# Altium schematic sheet LCA_GSM.SchDoc
size 420 x 297 mm; SheetNumber: 3; SheetTotal: 3
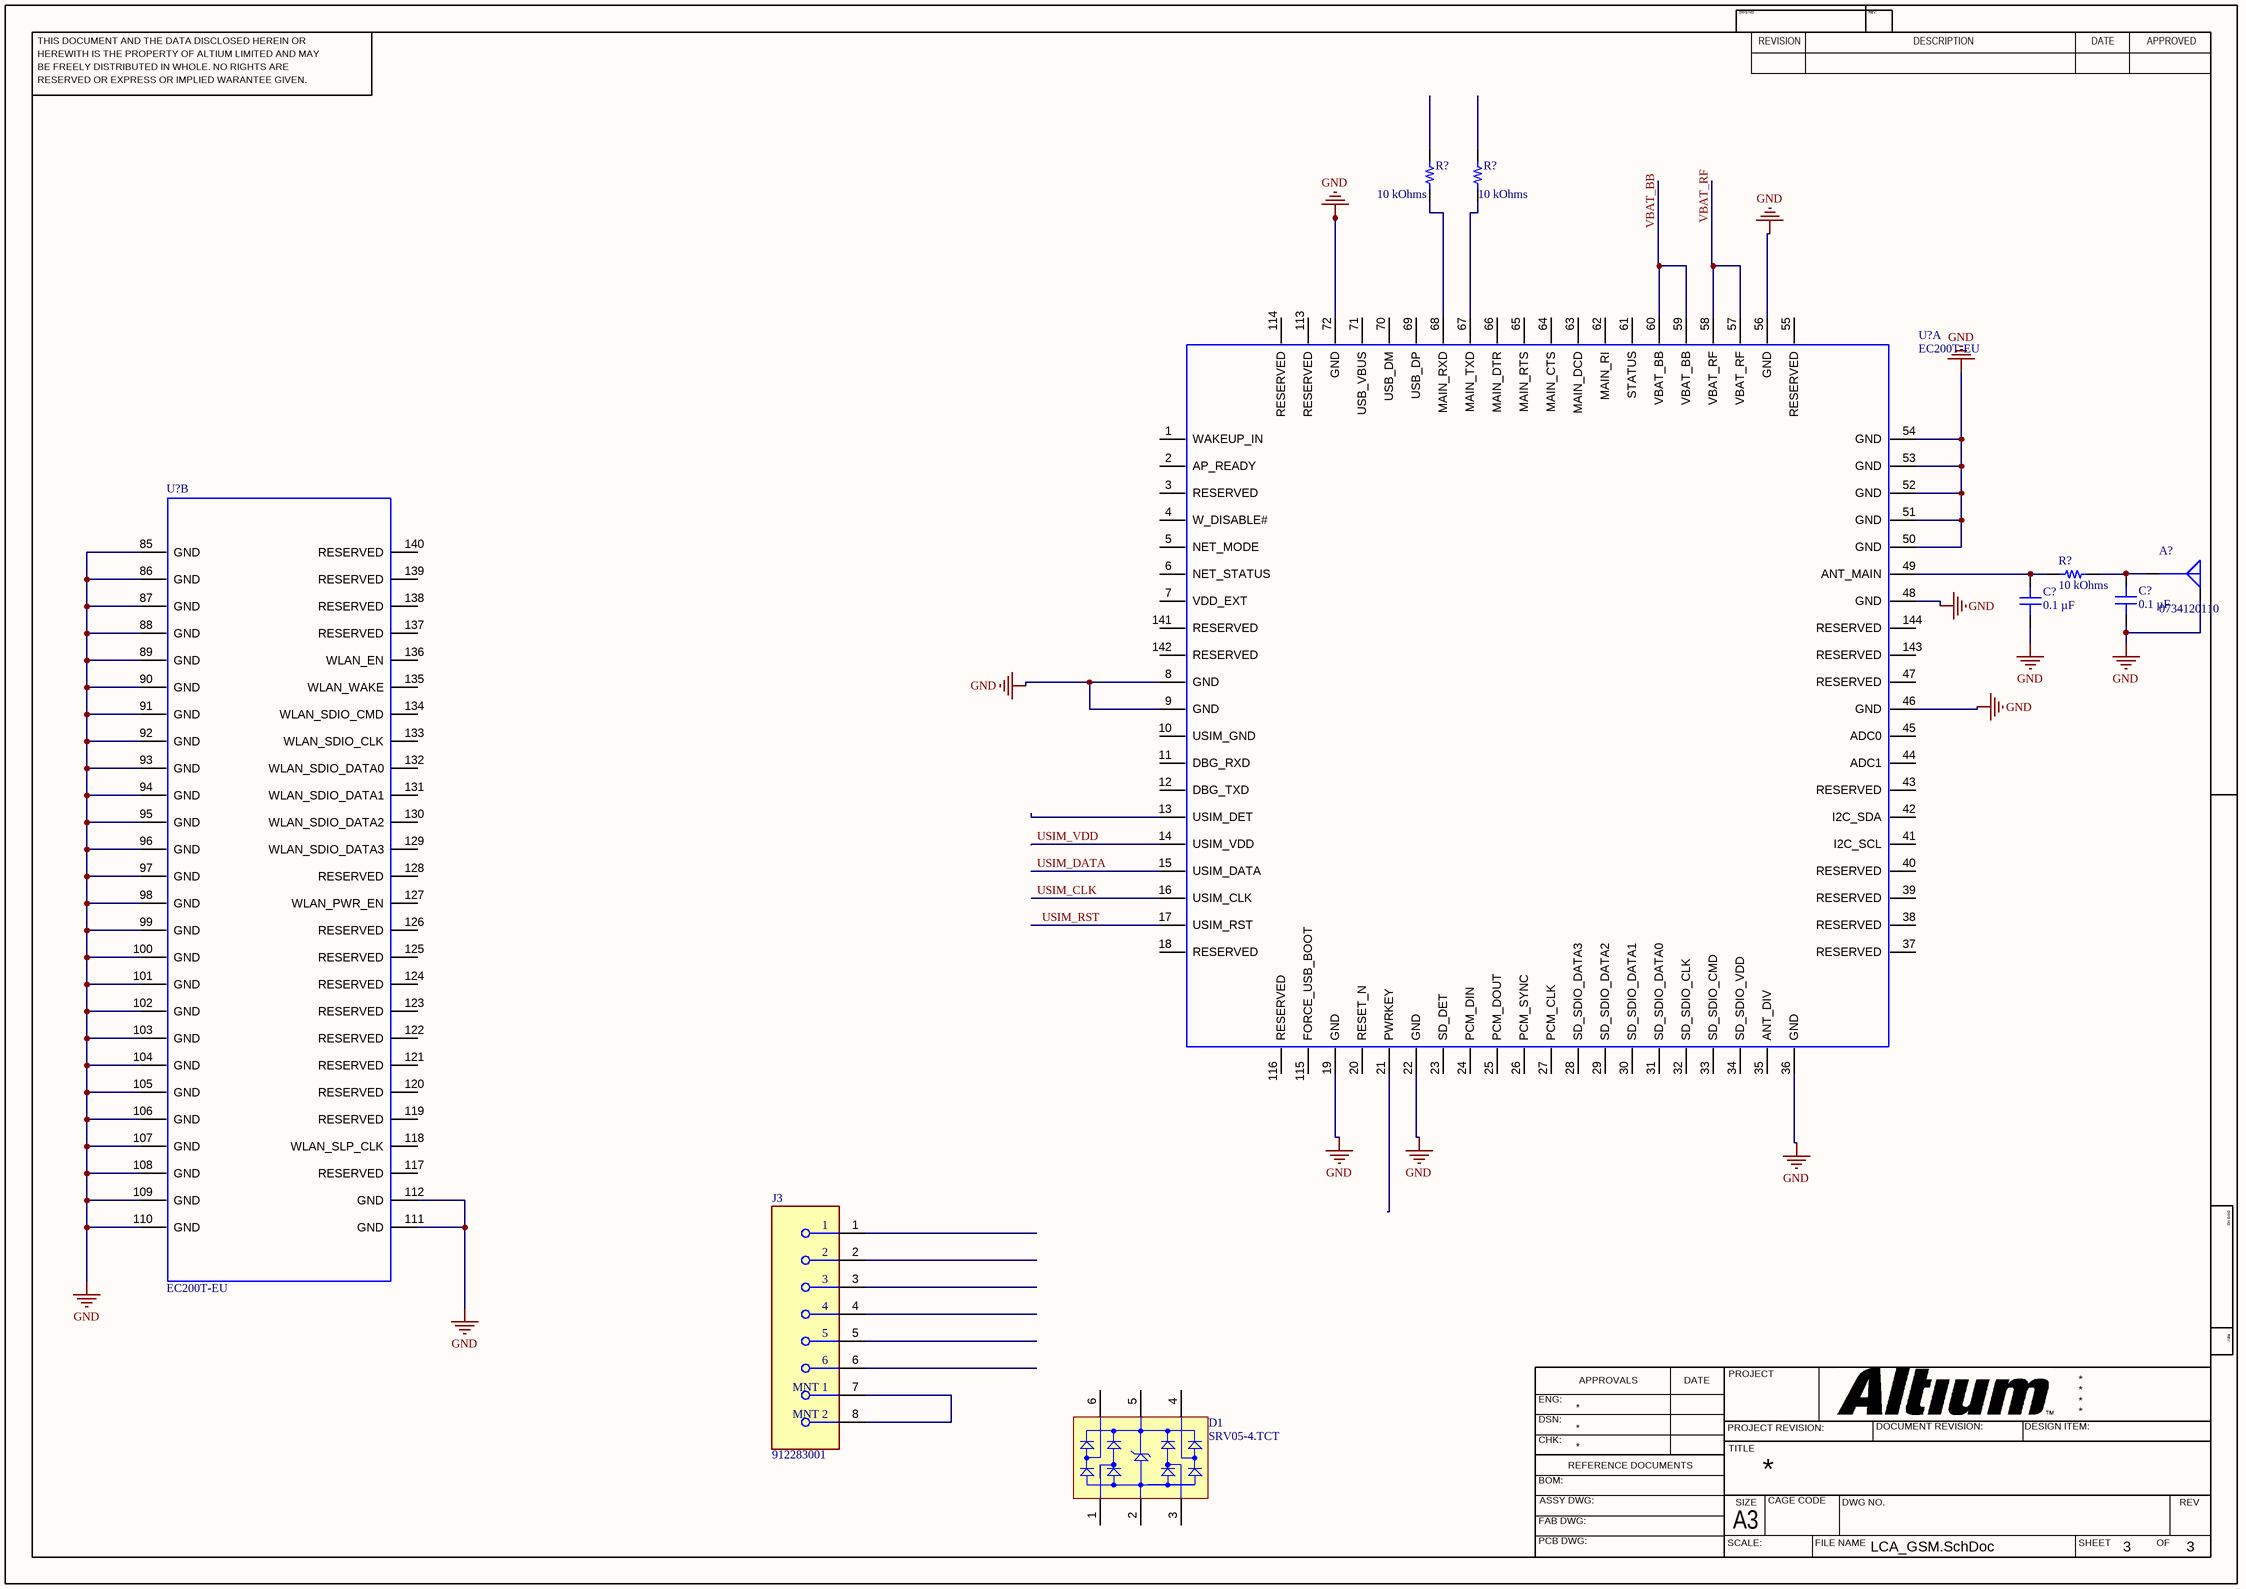
[diagram p0: LCA_GSM.SchDoc]

## Parts
(Parts that share a designator on the sheet are numbered #1, #2 ... from top to bottom, then left to right.)
A?  0734120110  [MOLEX SD-734120110]
C?#1  0.1 µF  [CAP 0603_1608]
C?#2  0.1 µF  [CAP 0603_1608]
D1  SRV05-4.TCT  [SMTC-SOT23-6_V]
J3  912283001  [FP-912283001-MFG]
R?#1  10 kOhms  [RES 0603_1608]
R?#2  10 kOhms  [RES 0603_1608]
R?#3  10 kOhms  [RES 0603_1608]
U?#1  EC200T-EU  [EC200T-CN]  (part A of 2)
U?#2  EC200T-EU  [EC200T-CN]  (part B of 2)

## Nets
GND: A?.G C?#1.1 C?#2.1 U?#1.8(GND) U?#1.9(GND) U?#1.19(GND) U?#1.22(GND) U?#1.36(GND) U?#1.46(GND) U?#1.48(GND) U?#1.50(GND) U?#1.51(GND) U?#1.52(GND) U?#1.53(GND) U?#1.54(GND) U?#1.56(GND) U?#1.72(GND) U?#2.85(GND) U?#2.86(GND) U?#2.87(GND) U?#2.88(GND) U?#2.89(GND) U?#2.90(GND) U?#2.91(GND) U?#2.92(GND) U?#2.93(GND) U?#2.94(GND) U?#2.95(GND) U?#2.96(GND) U?#2.97(GND) U?#2.98(GND) U?#2.99(GND) U?#2.100(GND) U?#2.101(GND) U?#2.102(GND) U?#2.103(GND) U?#2.104(GND) U?#2.105(GND) U?#2.106(GND) U?#2.107(GND) U?#2.108(GND) U?#2.109(GND) U?#2.110(GND) U?#2.111(GND) U?#2.112(GND)
USIM_CLK: U?#1.16(USIM_CLK)
USIM_DATA: U?#1.15(USIM_DATA)
USIM_RST: U?#1.17(USIM_RST)
USIM_VDD: U?#1.14(USIM_VDD)
VBAT_BB: U?#1.59(VBAT_BB) U?#1.60(VBAT_BB)
VBAT_RF: U?#1.57(VBAT_RF) U?#1.58(VBAT_RF)
NetA?_S: A?.S C?#2.2 R?#3.1
NetC?#1_2: C?#1.2 R?#3.2 U?#1.49(ANT_MAIN)
NetJ3_7: J3.7(MNT_1) J3.8(MNT_2)
NetR?#1_1: R?#1.1 U?#1.68(MAIN_RXD)
NetR?#2_1: R?#2.1 U?#1.67(MAIN_TXD)

Not connected (* = marked no-connect by the designer): D1 1(I/O_1) 2(GND) 3(I/O_2) 4(I/O_3) 5(VBUS) 6(I/O_4); J3 1 2 3 4 5 6; R?#1 2; R?#2 2; U?#1 1(WAKEUP_IN) 2(AP_READY) 3(RESERVED) 4(W_DISABLE#) 5(NET_MODE) 6(NET_STATUS) 7(VDD_EXT) 10(USIM_GND) 11(DBG_RXD) 12(DBG_TXD) 13(USIM_DET) 18(RESERVED) 20(RESET_N) 21(PWRKEY) 23(SD_DET) 24(PCM_DIN) 25(PCM_DOUT) 26(PCM_SYNC) 27(PCM_CLK) 28(SD_SDIO_DATA3) 29(SD_SDIO_DATA2) 30(SD_SDIO_DATA1) 31(SD_SDIO_DATA0) 32(SD_SDIO_CLK) 33(SD_SDIO_CMD) 34(SD_SDIO_VDD) 35(ANT_DIV) 37(RESERVED) 38(RESERVED) 39(RESERVED) 40(RESERVED) 41(I2C_SCL) 42(I2C_SDA) 43(RESERVED) 44(ADC1) 45(ADC0) 47(RESERVED) 55(RESERVED) 61(STATUS) 62(MAIN_RI) 63(MAIN_DCD) 64(MAIN_CTS) 65(MAIN_RTS) 66(MAIN_DTR) 69(USB_DP) 70(USB_DM) 71(USB_VBUS) 113(RESERVED) 114(RESERVED) 115(FORCE_USB_BOOT) 116(RESERVED) 141(RESERVED) 142(RESERVED) 143(RESERVED) 144(RESERVED); U?#2 117(RESERVED) 118(WLAN_SLP_CLK) 119(RESERVED) 120(RESERVED) 121(RESERVED) 122(RESERVED) 123(RESERVED) 124(RESERVED) 125(RESERVED) 126(RESERVED) 127(WLAN_PWR_EN) 128(RESERVED) 129(WLAN_SDIO_DATA3) 130(WLAN_SDIO_DATA2) 131(WLAN_SDIO_DATA1) 132(WLAN_SDIO_DATA0) 133(WLAN_SDIO_CLK) 134(WLAN_SDIO_CMD) 135(WLAN_WAKE) 136(WLAN_EN) 137(RESERVED) 138(RESERVED) 139(RESERVED) 140(RESERVED)

## Notes on the sheet
- THIS DOCUMENT AND THE DATA DISCLOSED HEREIN OR
- HEREWITH IS THE PROPERTY OF ALTIUM LIMITED AND MAY
- DWG NO:
- REVISION
- REV:
- DESCRIPTION
- DATE
- APPROVED
- BE FREELY DISTRIBUTED IN WHOLE. NO RIGHTS ARE
- RESERVED OR EXPRESS OR IMPLIED WARANTEE GIVEN.
- ENG:
- APPROVALS
- PROJECT
- DSN:
- CHK:
- REFERENCE DOCUMENTS
- PROJECT REVISION:
- TITLE
- DOCUMENT REVISION:
- DESIGN ITEM:
- BOM:
- FAB DWG:
- PCB DWG:
- ASSY DWG:
- SCALE:
- A3
- SIZE
- CAGE CODE
- FILE NAME
- DWG NO.
- SHEET
- OF
- REV

## Library data of the parts
A? = 0734120110: CONN UMC RCPT STR 50 OHM SMD; Manufacturer: Molex; Connector Type: Receptacle, Male Pin; Contact Termination: Solder; Frequency - Max: 6GHz; Impedance: 50Ohm; Number of Ports: 1; Part Number: 0734120110; ComponentLink1Description: Datasheet; ComponentLink1URL: https://www.molex.com/pdm_docs/ps/PS-73598-021-001.pdf; ComponentLink2Description: DigiKey Link; ComponentLink2URL: http://digikey.com/product-detail/en/molex/0734120110/WM5587CT-ND/1894612; Fastening Type: Snap-On; Housing Color: Silver; LastUpdated: 29-06-2022 18:16:06; Lifecycle Status: Active; Minimum Order: 1; Mounting Type: Surface Mount; Packaging: TapeAndReel; Part Status: Active; Price: 0.32; Series: 73412; Shield Termination: Solder; Supplier 1: DigiKey; Supplier Part Number 1: WM5587CT-ND
C?#1 C?#2 = C0603C104K5RAC7411: CAP CER 0.1UF 50V X7R 0603; manufacturer: KEMET; Tolerance: ±10%; Part Number: C0603C104K5RAC7411; Value: 0.1 µF; Applications: Bypass, Decoupling; Capacitance: 0.1 µF; componentlink1description: Datasheet; componentlink1url: https://api.kemet.com/component-edge/download/datasheet/C0603C104K5RAC7411.pdf; componentlink2description: DigiKey Link; componentlink2url: https://www.digikey.com/en/products/detail/kemet/C0603C104K5RAC7411/3317013; Device Package: 0603 (1608 Metric); lastupdated: 22-01-2024 20:10:23; Lifecycle Status: Active; Minimum Order: 1; Mounting Type: Surface Mount, MLCC; Operating Temperature: -55°C ~ 125°C; Package / Case: 0603 (1608 Metric); packaging: TapeAndReel; partid: 2233; Part Status: Active; price: 0.01; series: SMD Comm X7R; Size / Dimension: 0.063" L x 0.031" W (1.60mm x 0.80mm); Supplier 1: DigiKey; Supplier Part Number 1: 399-C0603C104K5RAC7411CT-ND; Temperature Coefficient: X7R; Thickness (Max): 0.035" (0.90mm); Voltage - Rated: 50V
D1 = CMP-2000-05358-1: RailClamp(R) Low Capacitance TVS Diode Array, 5 pF, 17.5 VC, -55 to 125 degC, 6-Pin SOT23, RoHS, Tape and Reel; Manufacturer: Semtech; Leakage Current (Max): 5uA; Polarity: Uni-Directional; Peak Pulse Power Dissipation: 300W; Clamping Voltage: 17.5V; Number of Elements: 1; Working Voltage: 5V; Test Current (It): 1mA; Configuration: Quad; Reverse Breakdown Voltage: 6V; Suppressor Type: DiodeArrays; Peak Pulse Current: 12A; Product Depth (mm): 1.6mm; Product Height (mm): 1.15mm; Clamping Voltage (Max): 12.5V; Rad Hardened: No; Product Length (mm): 2.9mm; Capacitance Value: 5pF; Mounting: SurfaceMount; Datasheet URL: https://datasheet.ciiva.com/8029/srv05-4-8029973.pdf; Datasheet Version: Jan-08; Packaging: TapeandReel; Package / Case: SOT-23; Operating Temp Range: -55Cto125C; Pin Count: 6; Direction Type: Uni-Directional; Operating Temperature Min Deg. C: -55C; Reverse Stand-off Voltage: 5V; Leakage Current: 5uA; Manufacturer URL: http://www.semtech.com/; Working Voltage (Max): 5V; Package Reference: SOT23-6; Package Description: 6-Pin Small Outline Transistor, Body 2.9 x 1.6 mm, Pitch 0.95 mm; Operating Temperature Max Deg. C: 125C; Operating Temperature Classification: Military; Mounting Style: SurfaceMount
J3 = CMP-2000-05710-2: CONN SIM CARD PUSH-PUSH R/A SMD; Manufacturer: Molex; Number Of Contacts: 6; Current Rating: 0.5A; Conn Gender: Female; Is Female: yes; Pitch: 2.54mm; Voltage Rating: 50V; Conn Orientation: Right Angle; Category: Conn; Automotive: No; ComponentLink2Description: Datasheet; Mouser Description: 2.54mm Pitch ChipSIM Connector with Ejector, 6 Circuits, without Pegs, Yellow Button; Lead Free: Yes; Height: 3.1mm; Temperature Range Low: -40°C; Device Class L1: Connectors; Device Class L3: unset; Manufacturer Part Number: 912283001; Footprint Url: https://www.molex.com/pdm_docs/sd/912283001_sd.pdf; Package: 0; Temperature: -40°C to +85°C; Octopart: https://octopart.com/91228-3001-molex-7135390; Contact Material: Gold,Nickel; RoHS: TRUE; Device Class L2: Card Edge Connectors; ComponentLink2URL: https://www.molex.com/webdocs/datasheets/pdf/en-us/0912283001_MEMORY_CARD_SOCKET.pdf; Temperature Range High: +85°C; Digikey Description: CONN SIM CARD PUSH-PUSH R/A SMD
R?#1-R?#3 = CPF0603B10KE: RES SMD 10K OHM 0.1% 1/16W 0603; Manufacturer: TE Connectivity Passive Product; Power (Watts): 0.063W, 1/16W; Temperature Coefficient: ±25ppm/°C; Part Number: CPF0603B10KE; Value: 10 kOhms; ComponentLink1Description: Datasheet; ComponentLink1URL: https://www.te.com/commerce/DocumentDelivery/DDEController?Action=srchrtrv&DocNm=1773200&DocType=DS&DocLang=English; ComponentLink2Description: DigiKey Link; ComponentLink2URL: https://www.digikey.com/en/products/detail/te-connectivity-passive-product/CPF0603B10KE/2389826; Composition: Thin Film; Device Package: 0603 (1608 Metric); Height - Seated (Max): 0.022" (0.55mm); LastUpdated: 06-02-2024 20:40:31; Lifecycle Status: Active; Minimum Order: 1; Number of Terminations: 2; Operating Temperature: -55°C ~ 155°C; Package / Case: 0603 (1608 Metric); Packaging: TapeAndReel; PartId: 4872; Part Status: Active; Price: 0.09; Resistance: 10 kOhms; Series: CPF, Neohm; Size / Dimension: 0.061" L x 0.031" W (1.55mm x 0.80mm); Supplier 1: DigiKey; Supplier Part Number 1: A119886CT-ND; Supplier Device Package: 0603; Tolerance: ±0.1%
U?#1 U?#2 = EC200T-CN: Part Description: EC200T-EU Moudle 144PIN 29x32mm; Manufacturer: Quectel; Geometry.Height: 2.6mm; Value: EC200T-EU